# Altium schematic sheet LED Strip.SchDoc
size A4; SheetNumber: 3; SheetTotal: 4
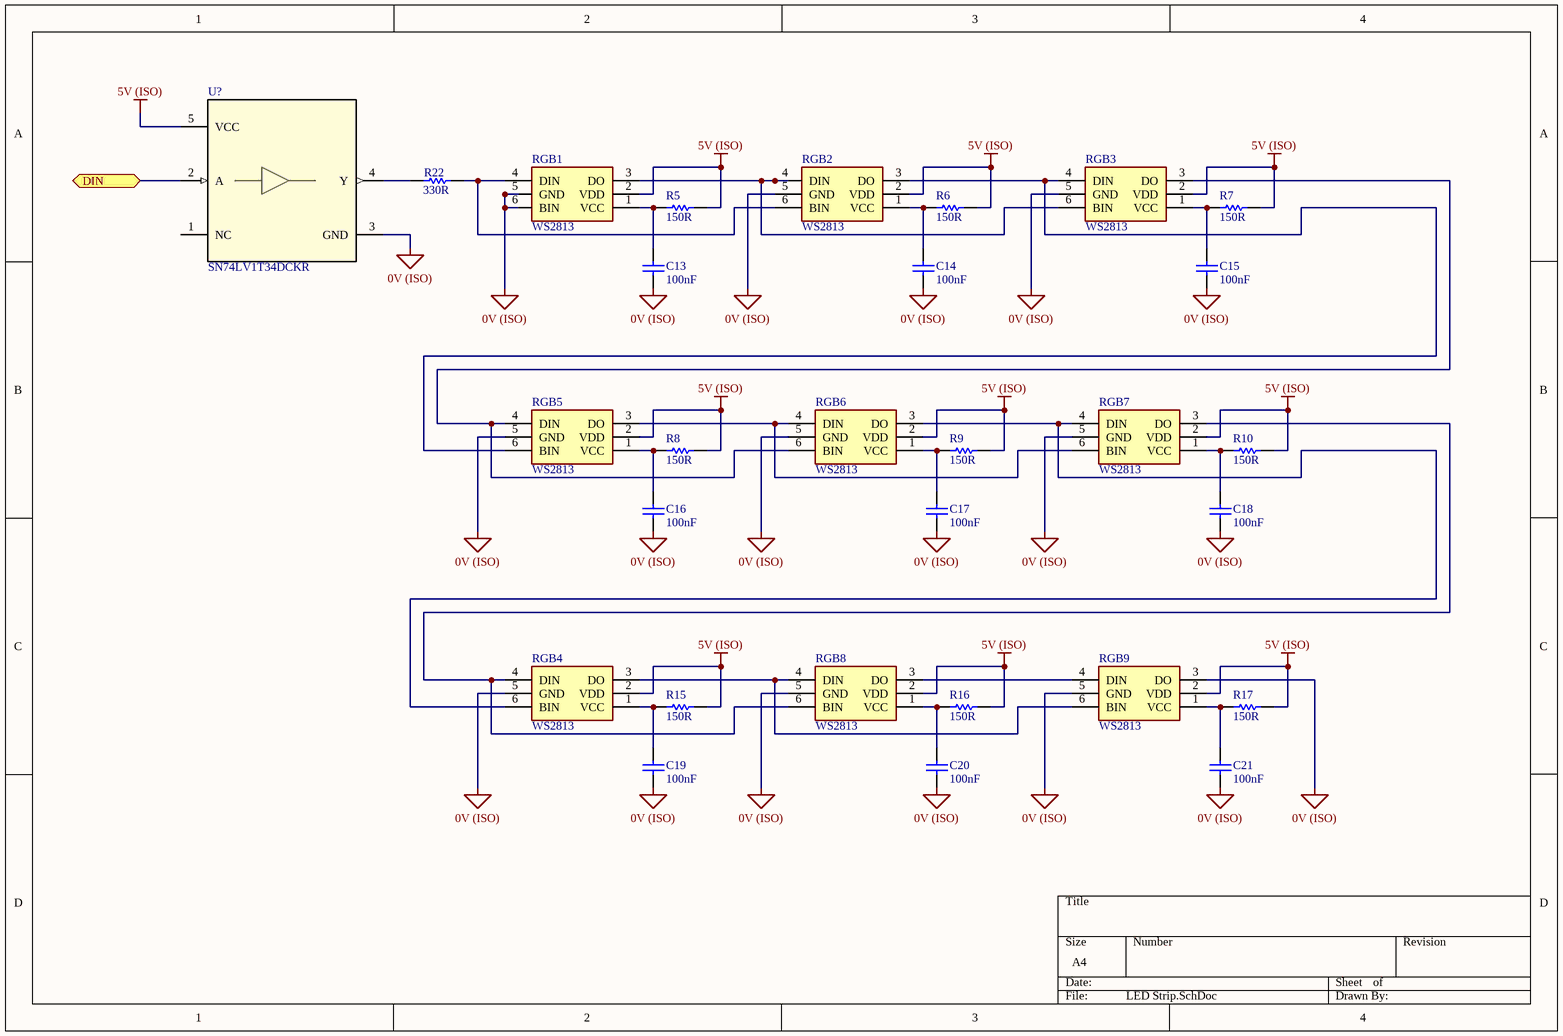
[diagram p0: LED Strip.SchDoc]

## Parts
C13  100nF  [0805]
C14  100nF  [0805]
C15  100nF  [0805]
C16  100nF  [0805]
C17  100nF  [0805]
C18  100nF  [0805]
C19  100nF  [0805]
C20  100nF  [0805]
C21  100nF  [0805]
R5  150R  [0805]
R6  150R  [0805]
R7  150R  [0805]
R8  150R  [0805]
R9  150R  [0805]
R10  150R  [0805]
R15  150R  [0805]
R16  150R  [0805]
R17  150R  [0805]
R22  330R  [0805]
RGB1  WS2813  [WS2812]
RGB2  WS2813  [WS2812]
RGB3  WS2813  [WS2812]
RGB4  WS2813  [WS2812]
RGB5  WS2813  [WS2812]
RGB6  WS2813  [WS2812]
RGB7  WS2813  [WS2812]
RGB8  WS2813  [WS2812]
RGB9  WS2813  [WS2812]
U?  SN74LV1T34DCKR  [DCK0005A_N]

## Ports
DIN (bidir)

## Nets
0V (ISO): C13.1 C14.2 C15.2 C16.2 C17.2 C18.2 C19.2 C20.2 C21.2 RGB1.5(GND) RGB1.6(BIN) RGB2.5(GND) RGB3.5(GND) RGB4.5(GND) RGB5.5(GND) RGB6.5(GND) RGB7.5(GND) RGB8.5(GND) RGB9.3(DO) RGB9.5(GND) U?.3(GND)
5V (ISO): R5.2 R6.2 R7.2 R8.2 R9.2 R10.2 R15.2 R16.2 R17.2 RGB1.2(VDD) RGB2.2(VDD) RGB3.2(VDD) RGB4.2(VDD) RGB5.2(VDD) RGB6.2(VDD) RGB7.2(VDD) RGB8.2(VDD) RGB9.2(VDD) U?.5(VCC)
DIN: U?.2(A) ; port DIN
NetC13_2: C13.2 R5.1 RGB1.1(VCC)
NetC14_1: C14.1 R6.1 RGB2.1(VCC)
NetC15_1: C15.1 R7.1 RGB3.1(VCC)
NetC16_1: C16.1 R8.1 RGB5.1(VCC)
NetC17_1: C17.1 R9.1 RGB6.1(VCC)
NetC18_1: C18.1 R10.1 RGB7.1(VCC)
NetC19_1: C19.1 R15.1 RGB4.1(VCC)
NetC20_1: C20.1 R16.1 RGB8.1(VCC)
NetC21_1: C21.1 R17.1 RGB9.1(VCC)
NetR22_1: R22.1 U?.4(Y)
NetR22_2: R22.2 RGB1.4(DIN) RGB2.6(BIN)
NetRGB1_3: RGB1.3(DO) RGB2.4(DIN) RGB3.6(BIN)
NetRGB2_3: RGB2.3(DO) RGB3.4(DIN) RGB5.6(BIN)
NetRGB3_3: RGB3.3(DO) RGB5.4(DIN) RGB6.6(BIN)
NetRGB4_3: RGB4.3(DO) RGB8.4(DIN) RGB9.6(BIN)
NetRGB4_4: RGB4.4(DIN) RGB7.3(DO) RGB8.6(BIN)
NetRGB4_6: RGB4.6(BIN) RGB6.3(DO) RGB7.4(DIN)
NetRGB5_3: RGB5.3(DO) RGB6.4(DIN) RGB7.6(BIN)
NetRGB8_3: RGB8.3(DO) RGB9.4(DIN)

Not connected (* = marked no-connect by the designer): U? 1(NC)

## Library data of the parts
C13-C21 = GCM21BR71H104KA37L: Manufacturer: muRata; Tolerance: ±10%; Material: X7R; Rated Voltage: 50V; Part Number: GCM21BR71H104KA37L; Value: 100nF; Digikey Part Number: 490-6064-1-ND
R5-R10 R15-R17 = RC0805FR07150RL: Manufacturer: YAGEO; Tolerance: 0.01; Rated Voltage: 0.125W; Part Number: RC0805FR07150RL; Value: 150R; Material: FR-07; Digikey Part Number: 311-150CRCT-ND
R22 = RC0805FR07330RL: Manufacturer: YAGEO; Tolerance: 0.01; Rated Voltage: 0.125W; Part Number: RC0805FR07330RL; Value: 330R; Material: FR-07; Digikey Part Number: 311-330CRCT-ND
RGB1-RGB9 = WS2813: LED; Manufacturer_Name: Worldsemi; Datasheet Link: http://www.tme.eu/gb/Document/cf443473af21167b0bdd177fb1a7e90a/WS2813.pdf; Manufacturer_Part_Number: WS2813
U? = SN74LV1T34DCKR: No Description Available; Manufacturer: Texas Instruments; CompType: IC; PIN_COUNT: 5; SymbolVerison: 2014-09-28; PartNumber: SN74LV1T34DCK; PackageReference: DCK0005A; MountType: SMT; RoHS: Y; RefDes: RefDes; Type: DEV; Value: Value; Copyright: Copyright (C) 2018 Accelerated Designs. All rights reserved